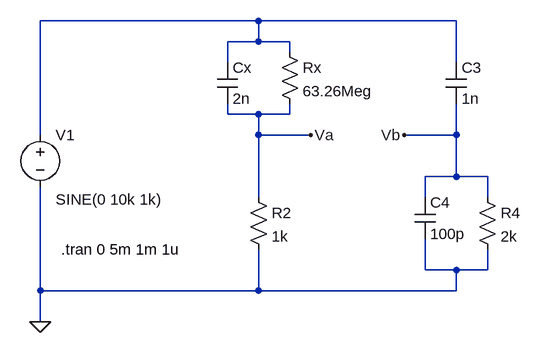
[diagram p0: schematic Schering.asc]
Schering.asc, the LTspice schematic file:
Version 4
SHEET 1 880 680
WIRE 112 80 -224 80
WIRE 416 80 112 80
WIRE 112 112 112 80
WIRE 112 112 64 112
WIRE 160 112 112 112
WIRE 160 128 160 112
WIRE 64 144 64 112
WIRE 416 144 416 80
WIRE 64 224 64 208
WIRE 112 224 64 224
WIRE 160 224 160 208
WIRE 160 224 112 224
WIRE -224 256 -224 80
WIRE 112 256 112 224
WIRE 192 256 112 256
WIRE 416 256 416 208
WIRE 416 256 336 256
WIRE 416 320 416 256
WIRE 416 320 368 320
WIRE 464 320 416 320
WIRE 112 352 112 256
WIRE 368 352 368 320
WIRE 464 352 464 320
WIRE 368 464 368 416
WIRE 416 464 368 464
WIRE 464 464 464 432
WIRE 464 464 416 464
WIRE -224 496 -224 336
WIRE 112 496 112 432
WIRE 112 496 -224 496
WIRE 416 496 416 464
WIRE 416 496 112 496
WIRE -224 544 -224 496
FLAG -224 544 0
FLAG 192 256 Va
FLAG 336 256 Vb
SYMBOL cap 400 144 R0
SYMATTR InstName C3
SYMATTR Value 1n
SYMBOL cap 352 352 R0
SYMATTR InstName C4
SYMATTR Value 100p
SYMBOL res 144 112 R0
SYMATTR InstName Rx
SYMATTR Value 63.26Meg
SYMBOL res 96 336 R0
SYMATTR InstName R2
SYMATTR Value 1k
SYMBOL res 448 336 R0
SYMATTR InstName R4
SYMATTR Value 2k
SYMBOL voltage -224 240 R0
WINDOW 3 24 115 Left 2
WINDOW 39 0 0 Left 2
SYMATTR InstName V1
SYMATTR Value SINE(0 10k 1k)
SYMATTR Value2 AC 1
SYMBOL cap 48 144 R0
SYMATTR InstName Cx
SYMATTR Value 2n
TEXT -192 432 Left 2 !.tran 0 5m 1m 1u

The netlist it stands for:
* Schering.asc
C3 N001 Vb 1n
C4 Vb 0 100p
Rx N001 Va 63.26Meg
R2 Va 0 1k
R4 Vb 0 2k
V1 N001 0 SINE(0 10k 1k) AC 1
Cx N001 Va 2n
.tran 0 5m 1m 1u
.backanno
.end